# EAGLE design finalpcb_tz12_fp10 (EAGLE 8.5.2)
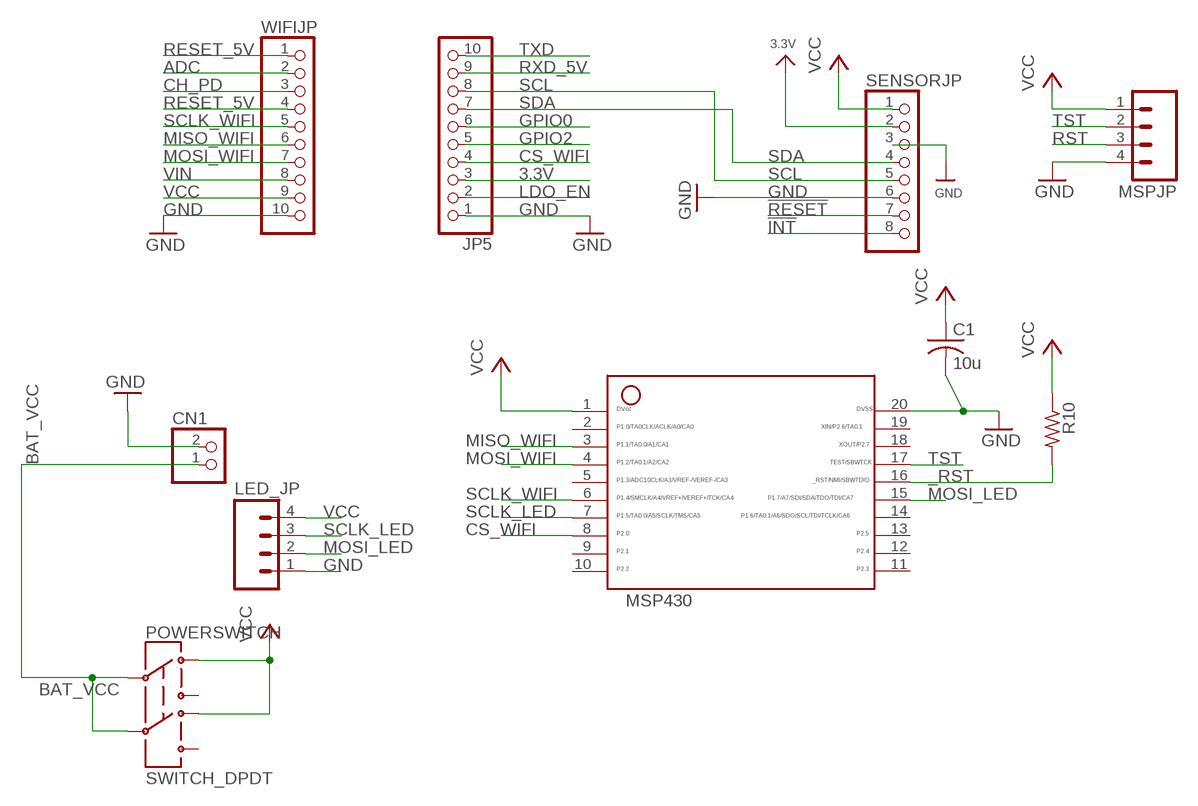
[diagram p0: schematic, sheet 1]

## Parts
C1  10u  C-USC1206  [C1206]
CN1  JST_2PIN-SMT-RA  [JST-PH-2-SMT-RA]
JP5  HEADER-1X1070MIL  [1X10_ROUND70]
LED_JP  PENDANT_M04LOCK  [PENDANT_1X04_LOCK]
MSP430  RATDBS_MSP430  [RATDBS_20_PIN]
MSPJP  PENDANT_M04LOCK  [PENDANT_1X04_LOCK]
POWERSWITCH  SWITCH_DPDT  [JS_DPDT_TH]
R10  R-US_R1206  [R1206]
SENSORJP  HEADER-1X870MIL  [1X08_ROUND_70]
WIFIJP  HEADER-1X1070MIL  [1X10_ROUND70]

## Nets
3.3V: JP5.3 SENSORJP.2
!INT: SENSORJP.8
!RESET: SENSORJP.7
_RST: MSP430.16 R10.2
ADC: WIFIJP.2
BAT_VCC: CN1.1 POWERSWITCH.2 POWERSWITCH.5
CH_PD: WIFIJP.3
CS_WIFI: JP5.4 MSP430.8
GND: C1.2 CN1.2 JP5.1 LED_JP.1 MSP430.20 MSPJP.4 SENSORJP.3 SENSORJP.6 WIFIJP.10
GPIO0: JP5.6
GPIO2: JP5.5
LDO_EN: JP5.2
MISO_WIFI: MSP430.3 WIFIJP.6
MOSI_LED: LED_JP.2 MSP430.15
MOSI_WIFI: MSP430.4 WIFIJP.7
RESET_5V: WIFIJP.1 WIFIJP.4
RST: MSPJP.3
RXD_5V: JP5.9
SCL: JP5.8 SENSORJP.5
SCLK_LED: LED_JP.3 MSP430.7
SCLK_WIFI: MSP430.6 WIFIJP.5
SDA: JP5.7 SENSORJP.4
TST: MSP430.17 MSPJP.2
TXD: JP5.10
VCC: C1.1 LED_JP.4 MSP430.1 MSPJP.1 POWERSWITCH.1 POWERSWITCH.4 R10.1 SENSORJP.1 WIFIJP.9
VIN: WIFIJP.8
Unconnected: MSP430.2 MSP430.5 MSP430.9 MSP430.10 MSP430.11 MSP430.12 MSP430.13 MSP430.14 MSP430.18 MSP430.19 POWERSWITCH.3 POWERSWITCH.6

## Library data of the parts
C1 = rcl:C-US: CAPACITOR, American symbol
CN1 = adafruit:JST_2PIN: JST 2-Pin Connectors of various flavors SMT-RA (S2B-PH-SM4) 4UConnector #17311 SMT (B2B-PH-SM4) THM-RA (S2B-PH) THM (B2B-PH)
JP5 WIFIJP = microbuilder:HEADER-1X10: PIN HEADER
LED_JP MSPJP = Pendant:PENDANT_M04: Header 4 Standard 4-pin 0.1" header. Use with straight break away headers (SKU : PRT-00116), right angle break away headers (PRT-00553), swiss pins (PRT-00743), machine pins (PRT-00117), and female headers (PRT-00115). Molex polarized connector foot print use with SKU : PRT-08231 with associated crimp pins and housings.
MSP430 = Pendant:RATDBS_MSP430: MSP430 20 pins
POWERSWITCH = ELEC327:SWITCH_DPDT
R10 = rcl:R-US_: RESISTOR, American symbol
SENSORJP = microbuilder:HEADER-1X8: PIN HEADER

## Board
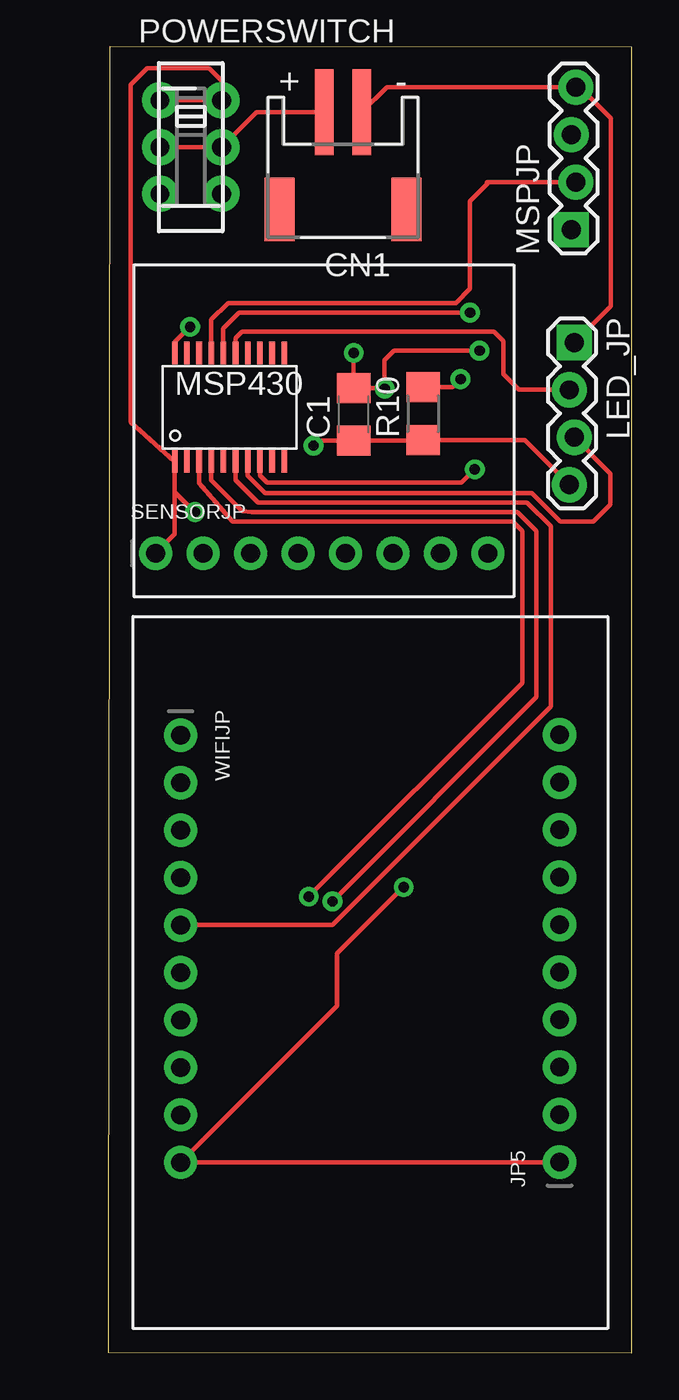
[diagram p1: board, top side]
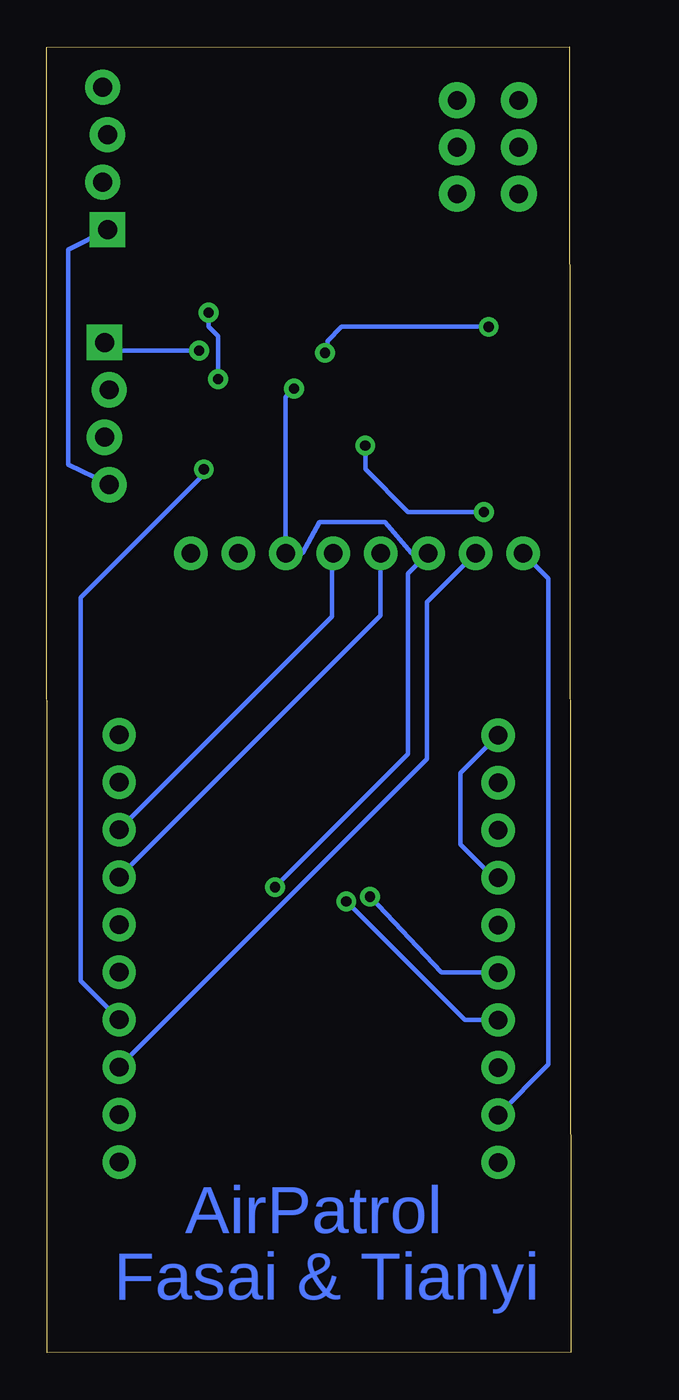
[diagram p2: board, bottom side, seen from below]

Size 28.05 x 69.87 mm. Coordinates in mm from the lower left corner, seen from the top.
Outline: 0,0.02 28.03,0 28.05,69.85 0.08,69.87 0,0.02
Copper layers (1*16): Top 0.035mm / dielectric 1.5mm / Bottom 0.035mm
Design rules "AdvancedCircuitsBarebones": minimum track width 6mil, minimum drill 20mil, track to track 6mil, track to pad 6mil, pad to pad 6mil, via to via 6mil, smd to smd 6mil, copper to edge 10mil, drill to drill 6mil, minimum pad ring 12mil, minimum via ring 10mil, stop-mask expansion 4mil, vias tented up to drill 25mil, thermal gap 10mil

### Footprints (pad centres in the part's own frame; a part is rotated, then mirrored left to right if it is on the bottom)
C1206 = smd 1.6 x 1.8: 1 -1.4,0; 2 1.4,0
JST-PH-2-SMT-RA = smd 1 x 4.6: 1 1,-3.7; 2 -1,-3.7 | smd 1.6 x 3.4: NC1 -3.4,1.5; NC2 3.4,1.5
1X10_ROUND70 = drill 1 pad 1.778: 1 -11.43,0; 2 -8.89,0; 3 -6.35,0; 4 -3.81,0; 5 -1.27,0; 6 1.27,0; 7 3.81,0; 8 6.35,0; 9 8.89,0; 10 11.43,0
PENDANT_1X04_LOCK = drill 1.016 pad 1.88 square: 1 0,0.127 | drill 1.016 pad 1.88: 2 2.54,-0.127; 3 5.08,0.127; 4 7.62,-0.127
RATDBS_20_PIN = smd 0.3 x 1.2: 1 -2.925,-2.9; 2 -2.275,-2.9; 3 -1.625,-2.9; 4 -0.975,-2.9; 5 -0.325,-2.9; 6 0.325,-2.9; 7 0.975,-2.9; 8 1.625,-2.9; 9 2.275,-2.9; 10 2.925,-2.9; 11 2.925,2.9; 12 2.275,2.9; 13 1.625,2.9; 14 0.975,2.9; 15 0.325,2.9; 16 -0.325,2.9; 17 -0.975,2.9; 18 -1.625,2.9; 19 -2.275,2.9; 20 -2.925,2.9
JS_DPDT_TH = drill 1 pad 1.93: 1 -2.5,-1.65; 2 0,-1.65; 3 2.5,-1.65; 4 -2.5,1.65; 5 0,1.65; 6 2.5,1.65
R1206 = smd 1.6 x 1.803: 1 -1.422,0; 2 1.422,0
1X08_ROUND_70 = drill 1 pad 1.778: 1 -8.89,0; 2 -6.35,0; 3 -3.81,0; 4 -1.27,0; 5 1.27,0; 6 3.81,0; 7 6.35,0; 8 8.89,0

### Placement (x,y rotation side)
C1  13.15,50.2 90 top
CN1  12.58,62.66 180 top
JP5  24.17,21.64 90 top
LED_JP  24.83,54.06 270 top
MSP430  6.51,50.58 0 top
MSPJP  24.92,60.09 90 top
POWERSWITCH  4.43,64.5 270 top
R10  16.87,50.24 90 top
SENSORJP  11.45,42.78 0 top
WIFIJP  3.89,21.61 270 top

### Tracks (layer width: path | path; a pad name or v marks a point on that pad's centre or on a via)
3.3V
  Bottom 0.254: JP5.3 7.7,31.77 7.7,40.15 5.1,42.75 SENSORJP.2
_RST  (via drill 0.55)
  Top 0.254: MSP430.16 6.17,53.24 6.17,54.8 7.02,55.65 v19.38,55.65 | v18.87,52.09 18.44,51.66 R10.2
  Bottom 0.254: v19.38,55.65 19.38,54.89 18.87,54.38 v18.87,52.09
BAT_VCC
  Top 0.254: CN1.1 7.94,66.36 POWERSWITCH.5 POWERSWITCH.2
CS_WIFI  (via drill 0.55)
  Top 0.254: MSP430.8 8.13,46.94 8.52,46.55 18.92,46.55 v19.63,47.27
  Bottom 0.254: JP5.4 26.24,19.89 26.24,40.41 19.63,47.01 v19.63,47.27
GND  (via drill 0.55)
  Top 0.254: CN1.2 14.93,67.71 MSPJP.4 25.25,67.71 26.9,66.06 26.9,65.97 26.9,65.96 26.9,56.16 26.9,56 LED_JP.1 | JP5.1 24.15,10.18 WIFIJP.10 12.27,18.56 12.27,21.36 v15.82,24.91 | 7.64,42.89 SENSORJP.3 | v13.16,53.49 v13.15,53.49 C1.2 14.79,51.6 v14.81,51.58 14.81,53.11 15.32,53.62 v19.89,53.62 | MSP430.20 3.58,54.07 v4.39,54.89
  Bottom 0.254: 24.89,54.12 LED_JP.1 24.52,53.62 v19.89,53.62 | v15.82,24.91 8.71,32.03 8.71,41.7 SENSORJP.3 8.52,42.78 9.95,44.45 13.45,44.45 14.37,42.78 SENSORJP.6 15.26,51.14 v14.81,51.58 | v4.39,54.89 12.27,54.89 13.03,54.12 13.03,53.62 v13.16,53.49
MISO_WIFI  (via drill 0.55)
  Top 0.254: MSP430.3 4.88,46.52 6.68,44.47 21.67,44.47 22.17,43.96 22.17,35.84 v10.74,24.41
  Bottom 0.254: v10.74,24.41 6.93,20.34 WIFIJP.6
MOSI_LED
  Top 0.254: MSP430.15 6.83,54.28 7.19,54.63 20.65,54.63 21.16,54.12 21.16,52.35 21.99,51.52 LED_JP.2
MOSI_WIFI  (via drill 0.55)
  Top 0.254: 12.01,23.9 v12.01,24.15 22.94,35.07 22.94,43.96 21.92,44.98 7.7,44.98 7.19,45.03 5.53,46.68 MSP430.4
  Bottom 0.254: v12.01,24.15 5.66,17.8 WIFIJP.7
RESET_5V
  Bottom 0.254: WIFIJP.1 5.92,31.01 5.92,27.2 4.14,25.42 WIFIJP.4
SCL
  Bottom 0.254: SENSORJP.5 12.78,42.72 12.78,39.39 24.17,27.99 JP5.8
SCLK_LED
  Top 0.254: LED_JP.3 26.9,47.03 26.9,45.49 26.9,45.39 25.98,44.47 24.21,44.47 22.68,46 8.42,46 7.48,46.94 MSP430.7
SCLK_WIFI
  Top 0.254: WIFIJP.5 12.01,22.88 23.7,34.57 23.7,44.22 22.43,45.49 8.03,45.49 6.83,46.68 MSP430.6
SDA
  Bottom 0.254: SENSORJP.4 10.18,39.45 JP5.7
TST
  Top 0.254: MSPJP.2 20.4,62.63 | 20.4,62.63 20.27,62.63 | 20.4,62.63 19.38,61.62 19.38,56.92 18.62,56.16 6.43,56.16 5.53,55.26 MSP430.17
VCC  (via drill 0.55)
  Top 0.254: POWERSWITCH.1 POWERSWITCH.4 6.08,68.05 5.41,68.73 2.11,68.73 1.22,67.84 1.22,49.79 MSP430.1 | MSP430.1 3.58,43.8 SENSORJP.1 | LED_JP.4 22.32,48.82 R10.1 16.85,48.8 C1.1 11.26,48.8 v11,48.54 | MSP430.1 3.58,46.05 v4.65,44.98
  Bottom 0.254: MSPJP.1 26.9,59.01 26.9,47.52 24.77,46.5 LED_JP.4 | v4.65,44.98 8.71,44.98 11,47.27 v11,48.54 | SENSORJP.1 1.2,41.42 1.19,41.42 1.19,15.42 WIFIJP.9

### Text on the board
Bottom: AirPatrol | Fasai & Tianyi